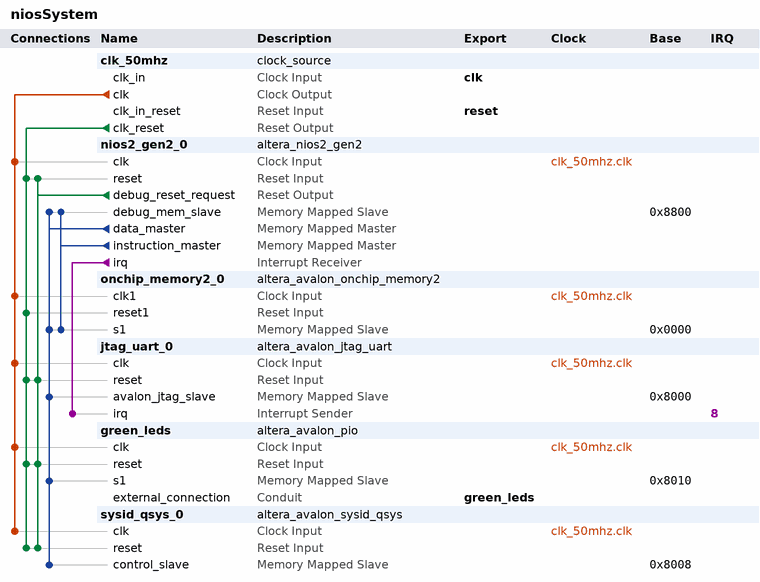
[diagram p0: system contents]
# Platform Designer (Qsys) system niosSystem, Cyclone IV E EP4CE115F29C7
# Parameters at their usual value, and those the tool derives, are not listed.
package require -exact qsys 19.1
create_system niosSystem
set_project_property DEVICE_FAMILY {Cyclone IV E}
set_project_property DEVICE EP4CE115F29C7

add_instance clk_50mhz clock_source 19.1
set_instance_parameter_value clk_50mhz clockFrequency 50000000

add_instance nios2_gen2_0 altera_nios2_gen2 19.1
set_instance_parameter_value nios2_gen2_0 dcache_size 2048
set_instance_parameter_value nios2_gen2_0 exceptionSlave onchip_memory2_0.s1
set_instance_parameter_value nios2_gen2_0 icache_size 4096
set_instance_parameter_value nios2_gen2_0 impl Fast
set_instance_parameter_value nios2_gen2_0 resetSlave onchip_memory2_0.s1

add_instance onchip_memory2_0 altera_avalon_onchip_memory2 19.1
set_instance_parameter_value onchip_memory2_0 dataWidth 32
set_instance_parameter_value onchip_memory2_0 dualPort false
set_instance_parameter_value onchip_memory2_0 initMemContent true
set_instance_parameter_value onchip_memory2_0 initializationFileName onchip_mem.hex
set_instance_parameter_value onchip_memory2_0 memorySize 20400

add_instance jtag_uart_0 altera_avalon_jtag_uart 19.1
set_instance_parameter_value jtag_uart_0 simInteractiveOptions NO_INTERACTIVE_WINDOWS

add_instance green_leds altera_avalon_pio 19.1
set_instance_parameter_value green_leds direction Output
set_instance_parameter_value green_leds width 8

add_instance sysid_qsys_0 altera_avalon_sysid_qsys 19.1
set_instance_parameter_value sysid_qsys_0 id 4112

# connections
add_connection clk_50mhz.clk green_leds.clk clock
add_connection clk_50mhz.clk jtag_uart_0.clk clock
add_connection clk_50mhz.clk nios2_gen2_0.clk clock
add_connection clk_50mhz.clk onchip_memory2_0.clk1 clock
add_connection clk_50mhz.clk sysid_qsys_0.clk clock
add_connection clk_50mhz.clk_reset green_leds.reset reset
add_connection clk_50mhz.clk_reset jtag_uart_0.reset reset
add_connection clk_50mhz.clk_reset nios2_gen2_0.reset reset
add_connection clk_50mhz.clk_reset onchip_memory2_0.reset1 reset
add_connection clk_50mhz.clk_reset sysid_qsys_0.reset reset
add_connection nios2_gen2_0.debug_reset_request green_leds.reset reset
add_connection nios2_gen2_0.debug_reset_request jtag_uart_0.reset reset
add_connection nios2_gen2_0.debug_reset_request nios2_gen2_0.reset reset
add_connection nios2_gen2_0.debug_reset_request sysid_qsys_0.reset reset
add_connection nios2_gen2_0.data_master green_leds.s1 avalon
set_connection_parameter_value nios2_gen2_0.data_master/green_leds.s1 baseAddress 0x8010
add_connection nios2_gen2_0.data_master jtag_uart_0.avalon_jtag_slave avalon
set_connection_parameter_value nios2_gen2_0.data_master/jtag_uart_0.avalon_jtag_slave baseAddress 0x8000
add_connection nios2_gen2_0.data_master nios2_gen2_0.debug_mem_slave avalon
set_connection_parameter_value nios2_gen2_0.data_master/nios2_gen2_0.debug_mem_slave baseAddress 0x8800
add_connection nios2_gen2_0.data_master onchip_memory2_0.s1 avalon
set_connection_parameter_value nios2_gen2_0.data_master/onchip_memory2_0.s1 baseAddress 0x0000
add_connection nios2_gen2_0.data_master sysid_qsys_0.control_slave avalon
set_connection_parameter_value nios2_gen2_0.data_master/sysid_qsys_0.control_slave baseAddress 0x8008
add_connection nios2_gen2_0.instruction_master nios2_gen2_0.debug_mem_slave avalon
set_connection_parameter_value nios2_gen2_0.instruction_master/nios2_gen2_0.debug_mem_slave baseAddress 0x8800
add_connection nios2_gen2_0.instruction_master onchip_memory2_0.s1 avalon
set_connection_parameter_value nios2_gen2_0.instruction_master/onchip_memory2_0.s1 baseAddress 0x0000
add_connection nios2_gen2_0.irq jtag_uart_0.irq interrupt
set_connection_parameter_value nios2_gen2_0.irq/jtag_uart_0.irq irqNumber 8

# exported interfaces
add_interface clk clock sink
set_interface_property clk EXPORT_OF clk_50mhz.clk_in
add_interface green_leds conduit end
set_interface_property green_leds EXPORT_OF green_leds.external_connection
add_interface reset reset sink
set_interface_property reset EXPORT_OF clk_50mhz.clk_in_reset

set_interconnect_requirement {$system} qsys_mm.clockCrossingAdapter HANDSHAKE
set_interconnect_requirement {$system} qsys_mm.enableEccProtection FALSE
set_interconnect_requirement {$system} qsys_mm.insertDefaultSlave FALSE
set_interconnect_requirement {$system} qsys_mm.maxAdditionalLatency 1

save_system niosSystem.qsys
